# EasyEDA Pro project EasyEDApro.epro

# Schematic Main board
Create Date: 2023-12-25; Page Name: Sheet_1.1; Project Name: Indoor Air Quality sensor; Schematic Name: Main board; Update Date: 2024-01-22; Company: Robonomics.network; Drawed: ludovich88; Page Size: A3; Part Number: ES-SDS-ESP8266; Reviewed: ludovich88; Version: V0.1
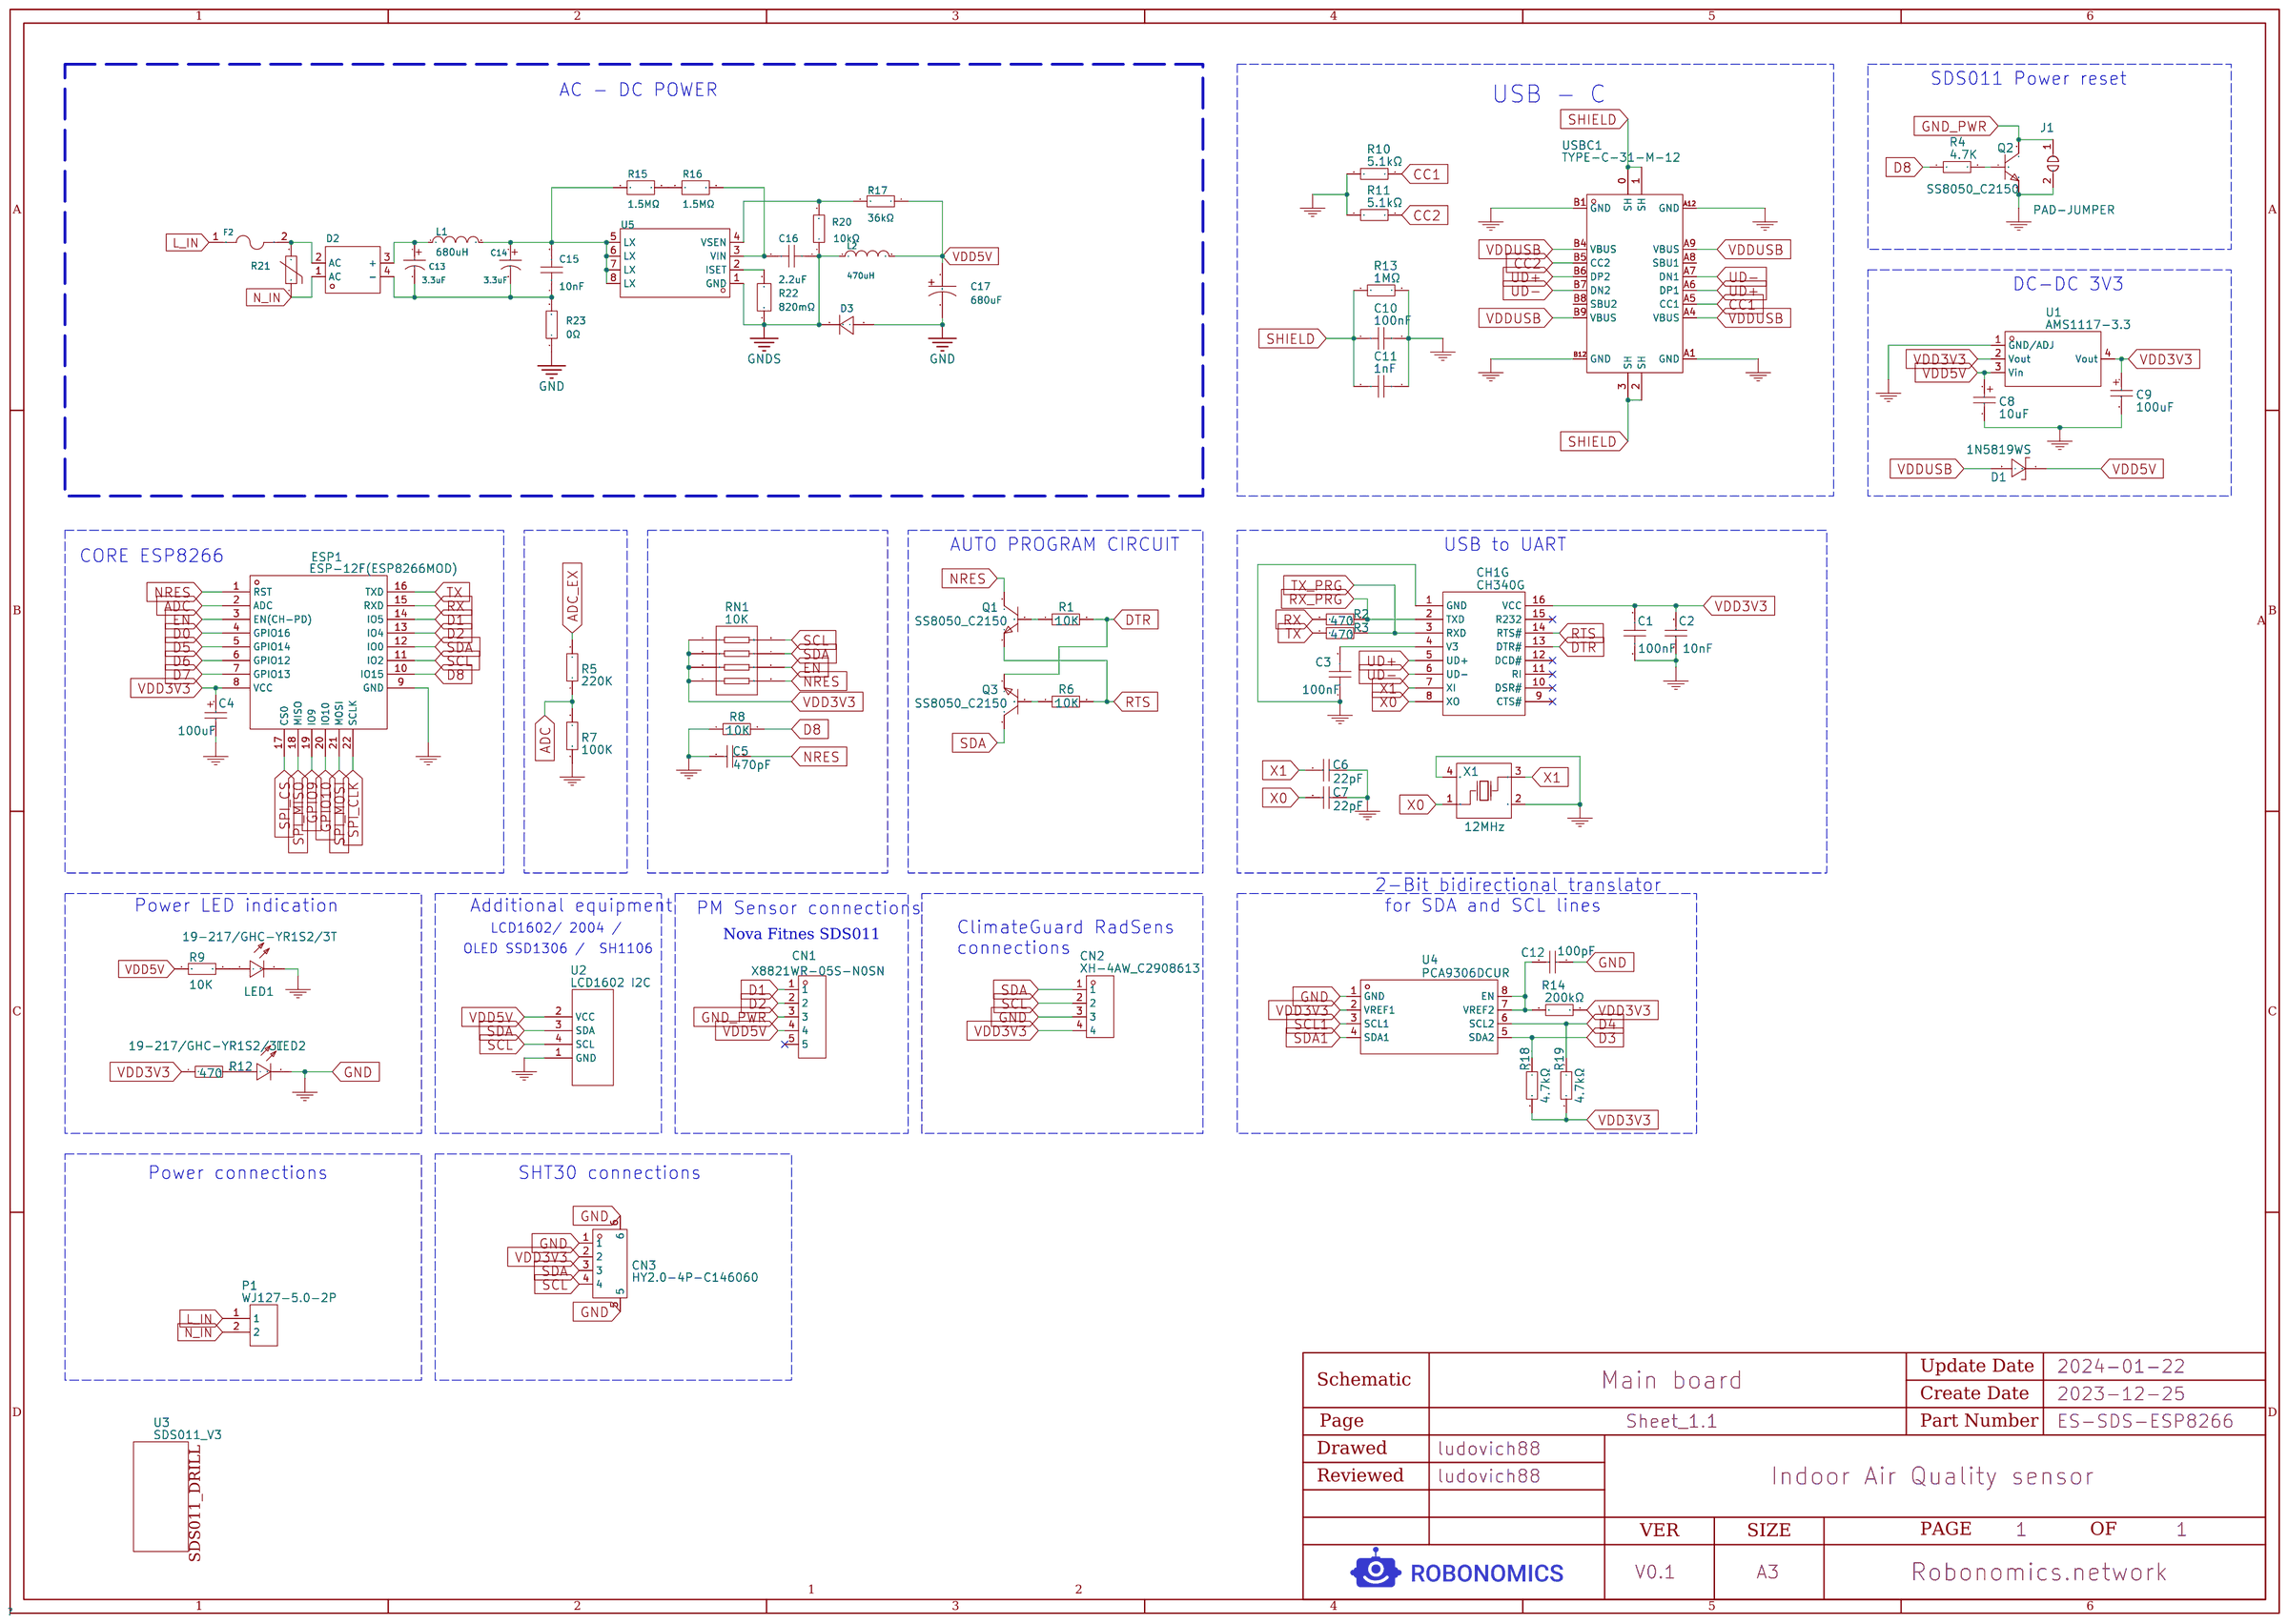
[diagram p0: schematic sheet]

## Parts
C1  100nF  [C0603]
C2  10nF  [C0603]
C3  100nF  [C0603]
C4  100uF  [CAP-SMD_L3.5-W2.8]
C5  470pF  [C0603]
C6  22pF  [C0603]
C7  22pF  [C0603]
C8  10uF  [CAP-SMD_L3.2-W1.6-R-RD]
C9  100uF  [CAP-SMD_L3.5-W2.8]
C10  100nF  [C0603]
C11  1nF  [C0603]
C12  100pF  [C0603]  (no BOM)
C13  3.3uF  [CAP-SMD_BD8.0-L8.3-W8.3-FD]
C14  3.3uF  [CAP-SMD_BD8.0-L8.3-W8.3-FD]
C15  10nF  [C1206]
C16  2.2uF  [C0805]
C17  680uF  [CAP-SMD_L7.3-W4.3]
CH1G  CH340G  [SOIC-16_150MIL]
CN1  X8821WR-05S-N0SN  [CONN-TH_5P-P2.50_X8821WR-05S-N0SN]
CN2  XH-4AW_C2908613  [CONN-TH_XH-4AW]
CN3  HY2.0-4P-C146060  [CONN-SMD_HY2.0-4P]
D1  1N5819WS  [SOD-323_L1.8-W1.3-LS2.5-RD]
D2  MB10F  [MBF_L4.8-W3.9-P2.50-LS6.7-BL]
D3  ES1J  [SMA_L4.3-W2.6-LS5.2-RD]
ESP1  ESP-12F(ESP8266MOD)  [WIFIM-SMD_ESP-12F-ESP8266MOD]
F2  JFC2410-1200FS  [F2410]
J1  PAD-JUMPER  [PAD-JUMPER-2_1]  (no BOM)
L1  680uH  [IND-SMD_L6.0-W6.0]
L2  470uH  [IND-SMD_L4.0-W4.0]
LED1  19-217/GHC-YR1S2/3T  [LED0603-R-RD]
LED2  19-217/GHC-YR1S2/3T  [LED0603-R-RD]
P1  WJ127-5.0-2P  [CONN-TH_2P-P5.00_CPC3703CTR]
Q1  SS8050_C2150  [SOT-23-3_L2.9-W1.3-P1.90-LS2.4-BR]
Q2  SS8050_C2150  [SOT-23-3_L2.9-W1.3-P1.90-LS2.4-BR]
Q3  SS8050_C2150  [SOT-23-3_L2.9-W1.3-P1.90-LS2.4-BR]
R1  10K  [R0603]
R2  470  [R0603]
R3  470  [R0603]
R4  4.7K  [R0603]
R5  220K  [R0603]
R6  10K  [R0603]
R7  100K  [R0603]
R8  10K  [R0603]
R9  10K  [R0603]
R10  5.1kΩ  [R0603]
R11  5.1kΩ  [R0603]
R12  470  [R0603]
R13  1MΩ  [R0603]
R14  200kΩ  [R0603]  (no BOM)
R15  1.5MΩ  [R1206]
R16  1.5MΩ  [R1206]
R17  36kΩ  [R0805]
R18  4.7kΩ  [R0603]  (no BOM)
R19  4.7kΩ  [R0603]  (no BOM)
R20  10kΩ  [R0805]
R21  07D471K68RV0149  [RES-SMD_L8.2-W6.3]
R22  820mΩ  [R0805]
R23  0Ω  [R0805]
RN1  10K  [RES-ARRAY-SMD_0603-8P-L3.2-W1.6-BL]
U1  AMS1117-3.3  [SOT-223-3_L6.5-W3.4-P2.30-LS7.0-BR]
U2  LCD1602 I2C  [LCD1620 I2C]  (no BOM)
U3  SDS011_V3  [SDS011_V3]  (no BOM)
U4  PCA9306DCUR  [SSOP-8_L2.0-W2.3-P0.50-LS3.1-BR]  (no BOM)
U5  SY50282FAC  [SOIC-8_L4.9-W3.9-P1.27-LS6.0-BL]
USBC1  TYPE-C-31-M-12  [USB-C_SMD-TYPE-C-31-M-12]
X1  12MHz  [OSC-SMD_4P-L3.2-W2.5-BL]

## Library data of the parts
C1 C3 C10 = CC0603KRX7R9BB104: Supplier: LCSC; Manufacturer: YAGEO; Supplier Part: C14663; JLCPCB Part Class: BasicPart
C2 = 0603B103K500NT: Supplier: LCSC; Manufacturer: FH; Supplier Part: C57112; JLCPCB Part Class: BasicPart
C4 C9 = TAJB107K006RNJ: Supplier: LCSC; Manufacturer: AVX; Supplier Part: C16133; JLCPCB Part Class: BasicPart
C5 = 0603B471K500NT: Supplier: LCSC; Manufacturer: FH; Supplier Part: C1620; JLCPCB Part Class: BasicPart
C6 C7 = CL10C220JB8NNNC: Supplier: LCSC; Manufacturer: SAMSUNG; Supplier Part: C1653; JLCPCB Part Class: BasicPart
C8 = CA45-A010M106T: Supplier: LCSC; Manufacturer: Xiangyee; Supplier Part: C127946; JLCPCB Part Class: ExtendedPart
C11 = GRM1885C1H102FA01D: Supplier: LCSC; Supplier Part: C913702; Manufacturer: muRata(村田); JLCPCB Part Class: ExtendedPart
C12 = CL10C101JB8NNNC: Supplier: LCSC; Manufacturer: SAMSUNG; Supplier Part: C14858; JLCPCB Part Class: BasicPart
C13 C14 = UV2G3R3M0810: Capacitance: Tolerance:±20% Tolerance:±20% Rated Voltage: Ripple Current:- Equivalent Series Resistance(ESR):- φD: L: Lifetime @ Temp:3000hrs@105℃ Operating Temperature:-45℃~+105℃ Operating Temperature:-45℃~+105℃; LCSC Part Name: 3.3uF ±20% 400V; Supplier Part: C98554; Manufacturer: HONOR(荣誉); Supplier Footprint: SMD,D8xL10.2mm; JLCPCB Part Class: Extended Part; Datasheet: https://atta.szlcsc.com/upload/public/pdf/source/20170311/1489227743043.pdf; Supplier: LCSC; Tolerance: ±20%; Lifetime @ Temp: 3000hrs@105℃; Operating Temperature: -45℃~+105℃
C15 = 1206B103K102CT_C77498: Capacitance:Tolerance:±10%Tolerance:±10%VoltageRated:TemperatureCoefficient:; LCSC Part Name: 10nF±10%1kV; Supplier Part: C77498; Manufacturer: Walsin(华新科); Manufacturer Part: 1206B103K102CT; Supplier Footprint: 1206; Datasheet: https://atta.szlcsc.com/upload/public/pdf/source/20180823/C77498_F5DB9DEE771DDE1CDD0779C01702A5D3.pdf; Supplier: LCSC; Tolerance: ±10%
C16 = CL21A225KBQNNNE: Capacitance:Tolerance:±10%Tolerance:±10%VoltageRated:TemperatureCoefficient:; LCSC Part Name: 2.2uF±10%50V; Supplier Part: C377773; Manufacturer: SAMSUNG(三星); Supplier Footprint: 0805; JLCPCB Part Class: ExtendedPart; Datasheet: https://atta.szlcsc.com/upload/public/pdf/source/20190327/C377773_F663556E8B678C5EA7A210E6B154453B.pdf; Supplier: LCSC; Tolerance: ±10%
C17 = TAJE687K006RNJ: Capacitance:Tolerance:±10%Tolerance:±10%RatedVoltage:EquivalentSeriesResistance(ESR):500mΩ@100kHzOperatingTemperature:-55℃~+125℃OperatingTemperature:-55℃~+125℃; LCSC Part Name: 680uF±10%6.3V; Supplier Part: C308811; Manufacturer: KyoceraAVX; Supplier Footprint: CASE-E-7343; JLCPCB Part Class: ExtendedPart; Datasheet: https://atta.szlcsc.com/upload/public/pdf/source/20181031/C308811_5A7B8BD02B1566F52935A1016FD2A024.pdf; Supplier: LCSC; Tolerance: ±10%; Equivalent Series Resistance(ESR): 500mΩ@100kHz; Operating Temperature: -55℃~+125℃
CH1G = CH340G: Supplier: LCSC; Manufacturer: WCH; image: //image.lceda.cn/szlcsc/C14267.jpg; Supplier Part: C14267; JLCPCB Part Class: Basic
CN1 = X8821WR-05S-N0SN: Supplier: LCSC; Supplier Part: C388742; Manufacturer: XKBConnectivity(中国星坤); JLCPCB Part Class: ExtendedPart
CN2 = XH-4AW: Supplier: LCSC; Supplier Part: C2908613; Manufacturer: HCTL(华灿天禄); JLCPCB Part Class: ExtendedPart
CN3 = HY-4P卧贴: Supplier: LCSC; Supplier Part: C146060; Manufacturer: BOOMELE(博穆精密); JLCPCB Part Class: ExtendedPart
D1 = 1N5819WS: Supplier: LCSC; Supplier Part: C191023; Manufacturer: GuangdongHottech; JLCPCB Part Class: BasicPart
D2 = MB10F_C306850: ReverseVoltage(Vr):AverageRectifiedCurrent(Io):ForwardVoltage(Vf@If):1V@500mAReverseLeakageCurrent(Ir):5uA@1kVPeakForwardSurgeCurrent:OperatingTemperature:-55℃~+150℃@(Tj)OperatingTemperature:-55℃~+150℃@(Tj); LCSC Part Name: 1kV800mA; Supplier Part: C306850; Manufacturer: BORN(伯恩半导体); Supplier Footprint: MBF; JLCPCB Part Class: ExtendedPart; Datasheet: https://atta.szlcsc.com/upload/public/pdf/source/20180927/C306850_59365E2CFC1E948275A4282033719DF3.pdf; Supplier: LCSC; Forward Voltage (Vf@If): 1V@500mA; Reverse Leakage Current (Ir): 5uA@1kV; Operating Temperature: -55℃~+150℃@(Tj)
D3 = ES1J_C115404: Supplier Part: C115404; Manufacturer: 晶导微电子; Supplier Footprint: SMA(DO-214AC); Datasheet: https://atta.szlcsc.com/upload/public/pdf/source/20170704/1499151315665.pdf; Supplier: LCSC
ESP1 = ESP-12F(ESP8266MOD): Supplier: LCSC; Manufacturer: Ai-Thinker; Supplier Part: C82891
F2 = JFC2410-1200FS: Type:SMD Fuse Current Rating:2A Voltage Rating  (AC):250V Breaking Capacity:50A Operating Temperature:-55℃~+125℃ Operating Temperature:-55℃~+125℃; LCSC Part Name: 250V贴片式保险丝; Supplier Part: C136365; Manufacturer: JDTfuse(集电通); Supplier Footprint: SMD; JLCPCB Part Class: Extended Part; Datasheet: https://atta.szlcsc.com/upload/public/pdf/source/20230515/4DD82964BD259009D7CA201DAB95185E.pdf; Supplier: LCSC; Type: SMD Fuse; Current Rating: 2A; Voltage Rating  (AC): 250V; Breaking Capacity: 50A; Operating Temperature: -55℃~+125℃
J1 = PAD-JUMPER
L1 = YNR6045-681M: Inductance:Tolerance:±20%Tolerance:±20%RatedCurrent:DCResistance(DCR):; LCSC Part Name: 680uH±20%330mA2.5Ω; Supplier Part: C497844; Manufacturer: YJYCOIN(益嘉源); Supplier Footprint: SMD,6x6mm; JLCPCB Part Class: ExtendedPart; Datasheet: https://atta.szlcsc.com/upload/public/pdf/source/20200317/C497838_ADAADDA66AFC043F2D8B9A62FB946728.pdf; Supplier: LCSC; Tolerance: ±20%
L2 = PNLS4030-471: Inductance: Tolerance:±20% Tolerance:±20% Rated Current: Type:磁胶电感 DC Resistance (DCR): Saturation Current (Isat):- Ratings:-; LCSC Part Name: 470uH ±20%; Supplier Part: C2849480; Manufacturer: DMBJ(振宝佳); Supplier Footprint: SMD,4x4x3mm; JLCPCB Part Class: Extended Part; Datasheet: https://atta.szlcsc.com/upload/public/pdf/source/20211011/C2849563_90EF936162E15AB6B17B47214801A168.pdf; Supplier: LCSC; Tolerance: ±20%; Type: 磁胶电感
LED1 LED2 = 19-217/GHC-YR1S2/3T: Supplier: LCSC; Manufacturer: EVERLIGHT; Supplier Part: C72043; JLCPCB Part Class: BasicPart
P1 = WJ127-5.0-2P: Supplier: LCSC; Manufacturer: KANGNEX(康奈克斯电气); Supplier Part: C3703; JLCPCB Part Class: ExtendedPart
Q1-Q3 = SS8050: Supplier: LCSC; Manufacturer: CJ; Supplier Part: C2150; JLCPCB Part Class: BasicPart
R1 R6 R8 R9 = 0603WAF1002T5E: Supplier: LCSC; Manufacturer: UniOhm; Supplier Part: C25804; JLCPCB Part Class: BasicPart
R2 R3 R12 = 0603WAF4700T5E: Supplier: LCSC; Manufacturer: UniOhm; Supplier Part: C23179; JLCPCB Part Class: BasicPart
R4 R18 R19 = 0603WAF4701T5E: Supplier: LCSC; Manufacturer: UniOhm; Supplier Part: C23162; JLCPCB Part Class: BasicPart
R5 = 0603WAF2203T5E: Supplier: LCSC; Manufacturer: UniOhm; Supplier Part: C22961; JLCPCB Part Class: BasicPart
R7 = 0603WAF1003T5E: Supplier: LCSC; Manufacturer: UniOhm; Supplier Part: C25803; JLCPCB Part Class: BasicPart
R10 R11 = 0603WAF5101T5E: Supplier: LCSC; Manufacturer: UNI-ROYAL(厚声); Supplier Part: C23186; Resistance: 5.1K; JLCPCB Part Class: BasicPart
R13 = 0603WAF1004T5E: Supplier: LCSC; Manufacturer: UNI-ROYAL(厚声); Supplier Part: C22935; Resistance: 1M; JLCPCB Part Class: BasicPart
R14 = 0603WAF2003T5E: Supplier: LCSC; Manufacturer: UniOhm; Supplier Part: C25811; Resistance: 200K; JLCPCB Part Class: BasicPart
R15 R16 = AC1206FR-071M5L: Power(Watts):250mWBodyLength:-Tolerance:OperatingTemperatureRange:OperatingTemperatureRange:φD:-BodyHeight:-Resistance:BodyWidth:-Type:ThickFilmResistorsTemperatureCoefficient:TemperatureCoefficient:OverloadVoltage(Max):; LCSC Part Name: 1.5MΩ±1%; Supplier Part: C229411; Manufacturer: YAGEO(国巨); Supplier Footprint: 1206; JLCPCB Part Class: ExtendedPart; Datasheet: https://atta.szlcsc.com/upload/public/pdf/source/20190415/C229411_FA1574342AB9C159EA3612F925293BBE.pdf; Supplier: LCSC; Power(Watts): 250mW; Type: ThickFilmResistors
R17 = 0805W8F3602T5E: Type:ThickFilmResistorsResistance:Tolerance:±1%Tolerance:±1%Power(Watts):TemperatureCoefficient:±100ppm/℃TemperatureCoefficient:±100ppm/℃OverloadVoltage(Max):OperatingTemperatureRange:-55℃~+155℃OperatingTemperatureRange:-55℃~+155℃; LCSC Part Name: 36kΩ±1%125mW; Supplier Part: C4360; Manufacturer: UNI-ROYAL(厚声); Supplier Footprint: 0805; JLCPCB Part Class: BasicPart; Datasheet: https://atta.szlcsc.com/upload/public/pdf/source/20200306/C422600_1E6D84923E4A46A82E41ADD87F860B5C.pdf; Supplier: LCSC; Type: ThickFilmResistors; Tolerance: ±1%; Temperature Coefficient: ±100ppm/℃; Operating Temperature Range: -55℃~+155℃
R20 = 0805W8F1002T5E: Type:ThickFilmResistorsResistance:Tolerance:±1%Tolerance:±1%Power(Watts):TemperatureCoefficient:±100ppm/℃TemperatureCoefficient:±100ppm/℃OverloadVoltage(Max):OperatingTemperatureRange:-55℃~+155℃OperatingTemperatureRange:-55℃~+155℃; LCSC Part Name: 10kΩ±1%125mW; Supplier Part: C17414; Manufacturer: UNI-ROYAL(厚声); Supplier Footprint: 0805; JLCPCB Part Class: BasicPart; Datasheet: https://atta.szlcsc.com/upload/public/pdf/source/20200306/C422600_1E6D84923E4A46A82E41ADD87F860B5C.pdf; Supplier: LCSC; Type: ThickFilmResistors; Tolerance: ±1%; Temperature Coefficient: ±100ppm/℃; Operating Temperature Range: -55℃~+155℃
R21 = 07D471K68RV0149: Allowable Voltage (AC): Allowable Voltage (DC): Varistor Voltage:423V~517V Varistor Voltage:423V~517V Clamping Voltage: Peak Current: Maximum Energy:20J Maximum Energy:20J Typical Capatitance:140pF@1kHz; LCSC Part Name: 贴片 775V 20焦耳; Supplier Part: C2836432; Manufacturer: KNSCHA(科尼盛); Supplier Footprint: SMD,3225; JLCPCB Part Class: Extended Part; Datasheet: https://atta.szlcsc.com/upload/public/pdf/source/20220505/AA8F3A0EE096C907DE4148B38AA17D85.pdf; Supplier: LCSC; Varistor Voltage: 423V~517V; Maximum Energy: 20J; Typical Capatitance: 140pF@1kHz
R22 = 0805W8F820LT5E: Resistance:820mΩ Tolerance:±1% Tolerance:±1% Power(Watts): Overload Voltage (Max): Temperature Coefficient:±800ppm/℃ Temperature Coefficient:±800ppm/℃ Type:Thick Film Resistors Operating Temperature Range:-55℃~+155℃ Operating Temperature Range:-55℃~+155℃; LCSC Part Name: 820mΩ ±1% 125mW 厚膜电阻; Supplier Part: C25267; Manufacturer: UNI-ROYAL(厚声); Supplier Footprint: 0805; JLCPCB Part Class: Extended Part; Datasheet: https://atta.szlcsc.com/upload/public/pdf/source/20200306/C422600_1E6D84923E4A46A82E41ADD87F860B5C.pdf; Supplier: LCSC; Tolerance: ±1%; Temperature Coefficient: ±800ppm/℃; Type: Thick Film Resistors; Operating Temperature Range: -55℃~+155℃
R23 = 0805W8J0000T5E: Type:ThickFilmResistorsResistance:Tolerance:±5%Tolerance:±5%Power(Watts):OverloadVoltage(Max):OperatingTemperatureRange:-55℃~+155℃OperatingTemperatureRange:-55℃~+155℃; LCSC Part Name: 0Ω±5%125mW; Supplier Part: C25275; Manufacturer: UNI-ROYAL(厚声); Supplier Footprint: 0805; Datasheet: https://atta.szlcsc.com/upload/public/pdf/source/20200306/C422600_1E6D84923E4A46A82E41ADD87F860B5C.pdf; Supplier: LCSC; Type: ThickFilmResistors; Tolerance: ±5%; Operating Temperature Range: -55℃~+155℃
RN1 = 4D03WGJ0103T5E: Supplier: LCSC; Manufacturer: UniOhm; Supplier Part: C29718; JLCPCB Part Class: BasicPart
U1 = AMS1117-3.3: Supplier: LCSC; Manufacturer: AMS; Supplier Part: C6186; JLCPCB Part Class: BasicPart
U2 = LCD1602 I2C: Manufacturer Part: LCD1602I2C
U3 = SDS011_V3
U4 = PCA9306DCUR: Supplier: LCSC; Manufacturer: TI; Supplier Part: C33196; JLCPCB Part Class: ExtendedPart
U5 = SY50282FAC: Supplier Part: C178237; Manufacturer: silergy(矽力杰); Supplier Footprint: SOIC-8; JLCPCB Part Class: ExtendedPart; Datasheet: https://atta.szlcsc.com/upload/public/pdf/source/20180207/C178237_15179896323851356347.pdf; Supplier: LCSC
USBC1 = KH-TYPE-C-16P: Supplier: LCSC; Supplier Part: C709357; Manufacturer: kinghelm(金航标); JLCPCB Part Class: ExtendedPart
X1 = X322512MSB4SI: Supplier: LCSC; Manufacturer: YXC; Supplier Part: C9002; JLCPCB Part Class: BasicPart

## Nets
GND: C1.1 C2.1 C3.1 C4.2 C5.1 C6.1 C7.1 C8.1 C9.2 C10.2 C11.2 C12.1 C17.2 CH1G.1(GND) CN2.3 CN3.1 CN3.5 CN3.6 D3.2(A) ESP1.9(GND) J1.2(B) LED1.2(C) LED2.2(C) Q2.2(E) R7.1 R8.1 R10.1 R11.1 R13.2 R23.1 U1.1(GND/ADJ) U2.1(GND) U4.1(GND) USBC1.A1(GND) USBC1.A12(GND) USBC1.B1(GND) USBC1.B12(GND) X1.2(GND) X1.4(GND)
GND_PWR: CN1.3 J1.1(A) Q2.3(C)
GNDS: C16.1 D3.1(C) L2.1 R20.1 R22.1 U5.1(GND)
VDD3V3: C1.2 C2.2 C4.1 C9.1 CH1G.16(VCC) CN2.4 CN3.2 ESP1.8(VCC) R12.1 R14.2 R18.2 R19.2 RN1.1 RN1.2 RN1.3 RN1.4 U1.2(Vout) U1.4(Vout) U4.2(VREF1)
VDD5V: C8.2 C17.1 CN1.4 D1.1(C) L2.2 R9.1 R17.1 U1.3(Vin) U2.2(VCC)
VDDUSB: D1.2(A) USBC1.A4(VBUS) USBC1.A9(VBUS) USBC1.B4(VBUS) USBC1.B9(VBUS)
ADC: ESP1.2(ADC) R5.1 R7.2
ADC_EX: R5.2
CC1: R10.2 USBC1.A5(CC1)
CC2: R11.2 USBC1.B5(CC2)
D0: ESP1.4(GPIO16)
D1: CN1.1 ESP1.14(IO5)
D2: CN1.2 ESP1.13(IO4)
D3: R18.1 U4.5(SDA2)
D4: R19.1 U4.6(SCL2)
D5: ESP1.5(GPIO14)
D6: ESP1.6(GPIO12)
D7: ESP1.7(GPIO13)
D8: ESP1.10(IO15) R4.1 R8.2
DTR: CH1G.13(DTR#) Q3.2(E) R1.2
EN: ESP1.3(EN(CH-PD)) RN1.6
GPIO9: ESP1.19(IO9)
GPIO10: ESP1.20(IO10)
L_IN: F2.1 P1.1
N_IN: D2.1(AC) P1.2 R21.1
NRES: C5.2 ESP1.1(RST) Q1.3(C) RN1.5
RTS: CH1G.14(RTS#) Q1.2(E) R6.2
RX: ESP1.15(RXD) R2.1
RX_PRG: CH1G.2(TXD) R2.2
SCL: CN2.2 CN3.4 ESP1.11(IO2) RN1.8 U2.4(SCL)
SCL1: U4.3(SCL1)
SDA: CN2.1 CN3.3 ESP1.12(IO0) Q3.3(C) RN1.7 U2.3(SDA)
SDA1: U4.4(SDA1)
SHIELD: C10.1 C11.1 R13.1 USBC1.0(SH) USBC1.1(SH) USBC1.2(SH) USBC1.3(SH)
SPI_CLK: ESP1.22(SCLK)
SPI_CS: ESP1.17(CS0)
SPI_MISO: ESP1.18(MISO)
SPI_MOSI: ESP1.21(MOSI)
TX: ESP1.16(TXD) R3.1
TX_PRG: CH1G.3(RXD) R3.2
UD+: CH1G.5(UD+) USBC1.A6(DP1) USBC1.B6(DP2)
UD-: CH1G.6(UD-) USBC1.A7(DN1) USBC1.B7(DN2)
X0: C7.2 CH1G.8(XO) X1.1(OSC1)
X1: C6.2 CH1G.7(XI) X1.3(OSC2)
$1N258: Q3.1(B) R6.1
$1N259: Q1.1(B) R1.1
$1N445: C3.2 CH1G.4(V3)
$1N571: Q2.1(B) R4.2
$1N918: LED1.1(A) R9.2
$1N1452: LED2.1(A) R12.2
$1N12391: R15.2 R16.1
$1N12392: R22.2 U5.2(ISET)
$1N12393: C16.2 R16.2 U5.3(VIN)
$1N12394: R17.2 R20.2 U5.4(VSEN)
$1N12400: C13.1 D2.3(+) L1.1
$1N12406: D2.2(AC) F2.2 R21.2
$1N12488: C14.1 C15.2 L1.2 R15.1 U5.5(LX) U5.6(LX) U5.7(LX) U5.8(LX)
$1N12654: C13.2 C14.2 C15.1 D2.4(-) R23.2
Net-(C12-2): C12.2 R14.1 U4.7(VREF2) U4.8(EN)

Not connected (* = marked no-connect by the designer): CH1G 9(CTS#)* 10(DSR#)* 11(RI)* 12(DCD#)* 15(R232)*; CN1 5*; USBC1 A8(SBU1) B8(SBU2)

## Notes on the sheet
- SDS011 Power reset
- AC - DC POWER
- USB - C
- DC-DC 3V3
- CORE ESP8266
- AUTO PROGRAM CIRCUIT
- USB to UART
- Power LED indication
- Additional equipment
- PM Sensor connections
- ClimateGuard RadSens
  connections
- 2-Bit bidirectional translator
   for SDA and SCL lines
- LCD1602/ 2004 /
- OLED SSD1306 /  SH1106
- Nova Fitnes SDS011
- Power connections
- SHT30 connections

# Board PCB
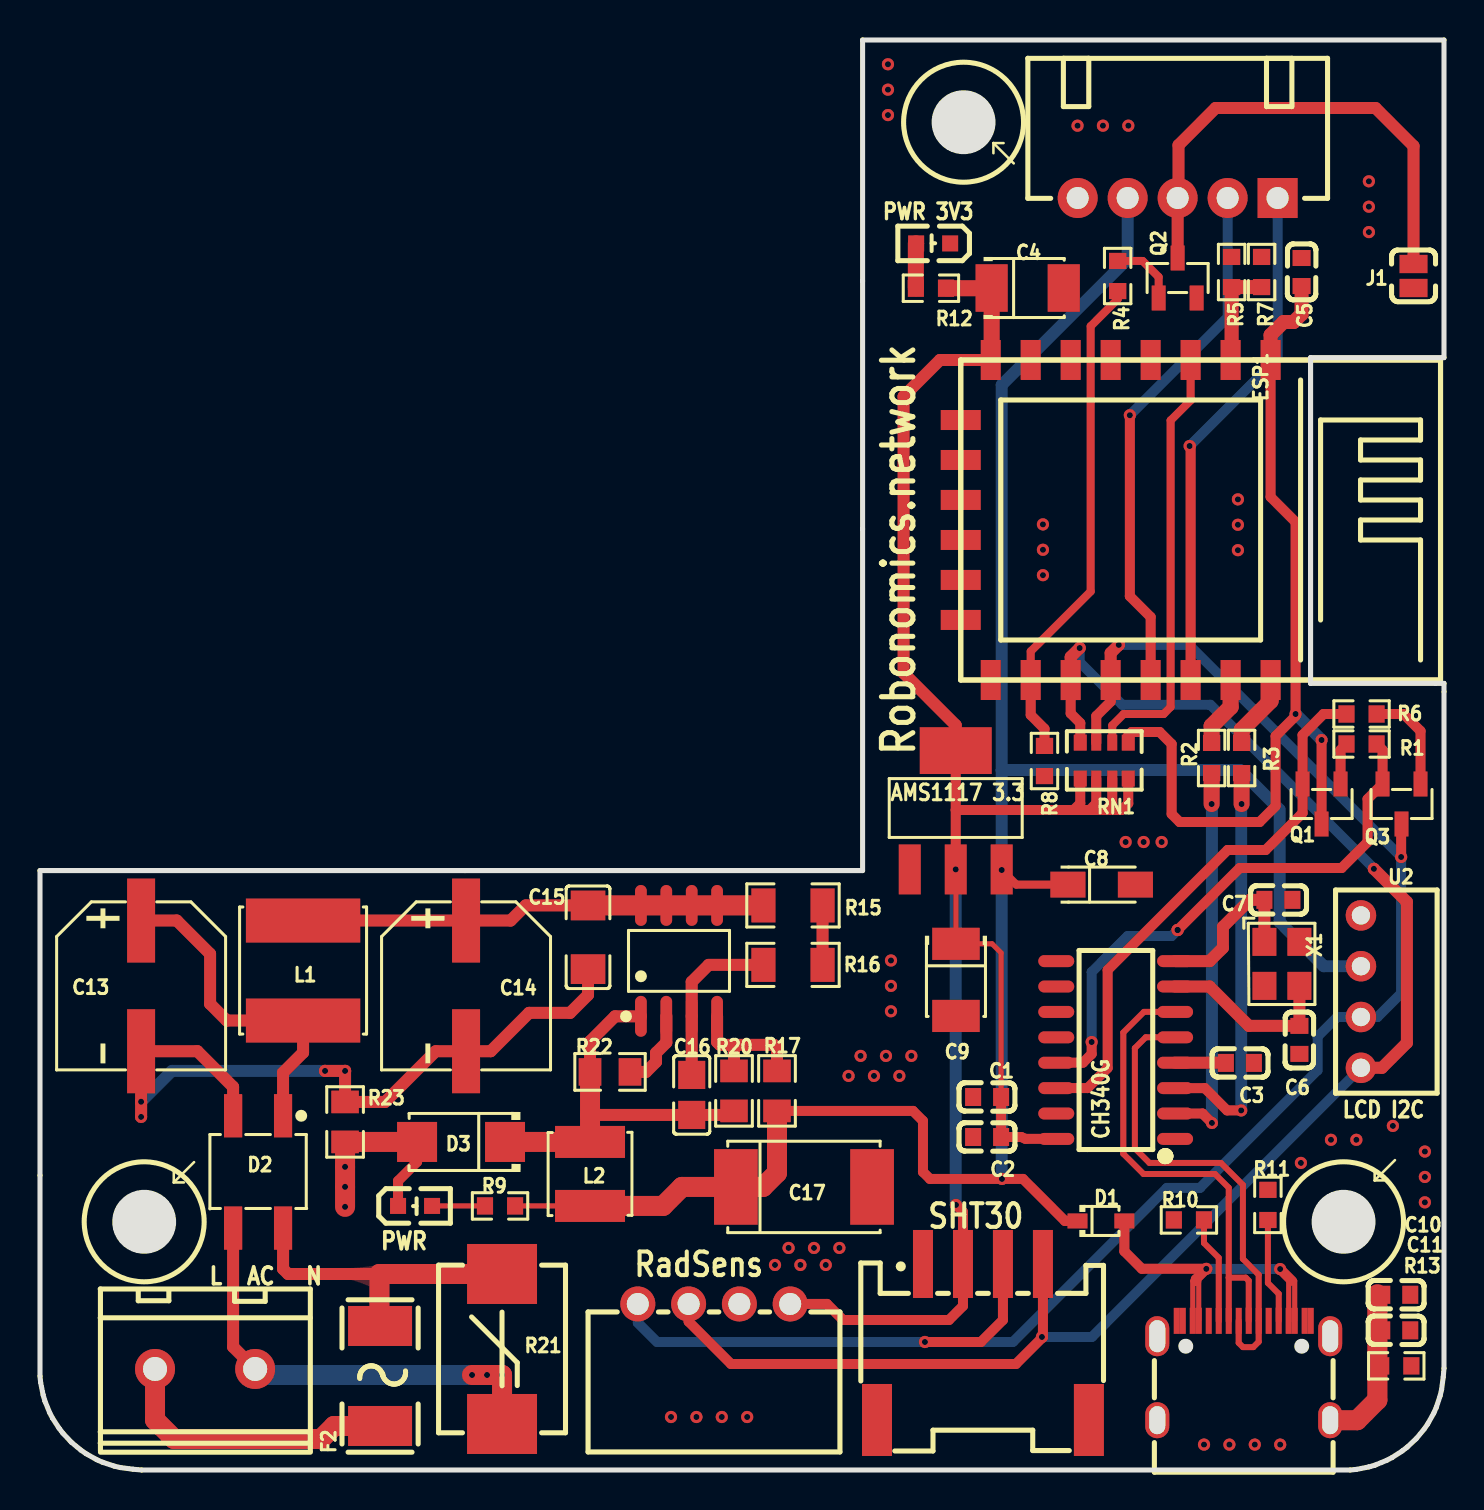
[diagram p1: board, top side]
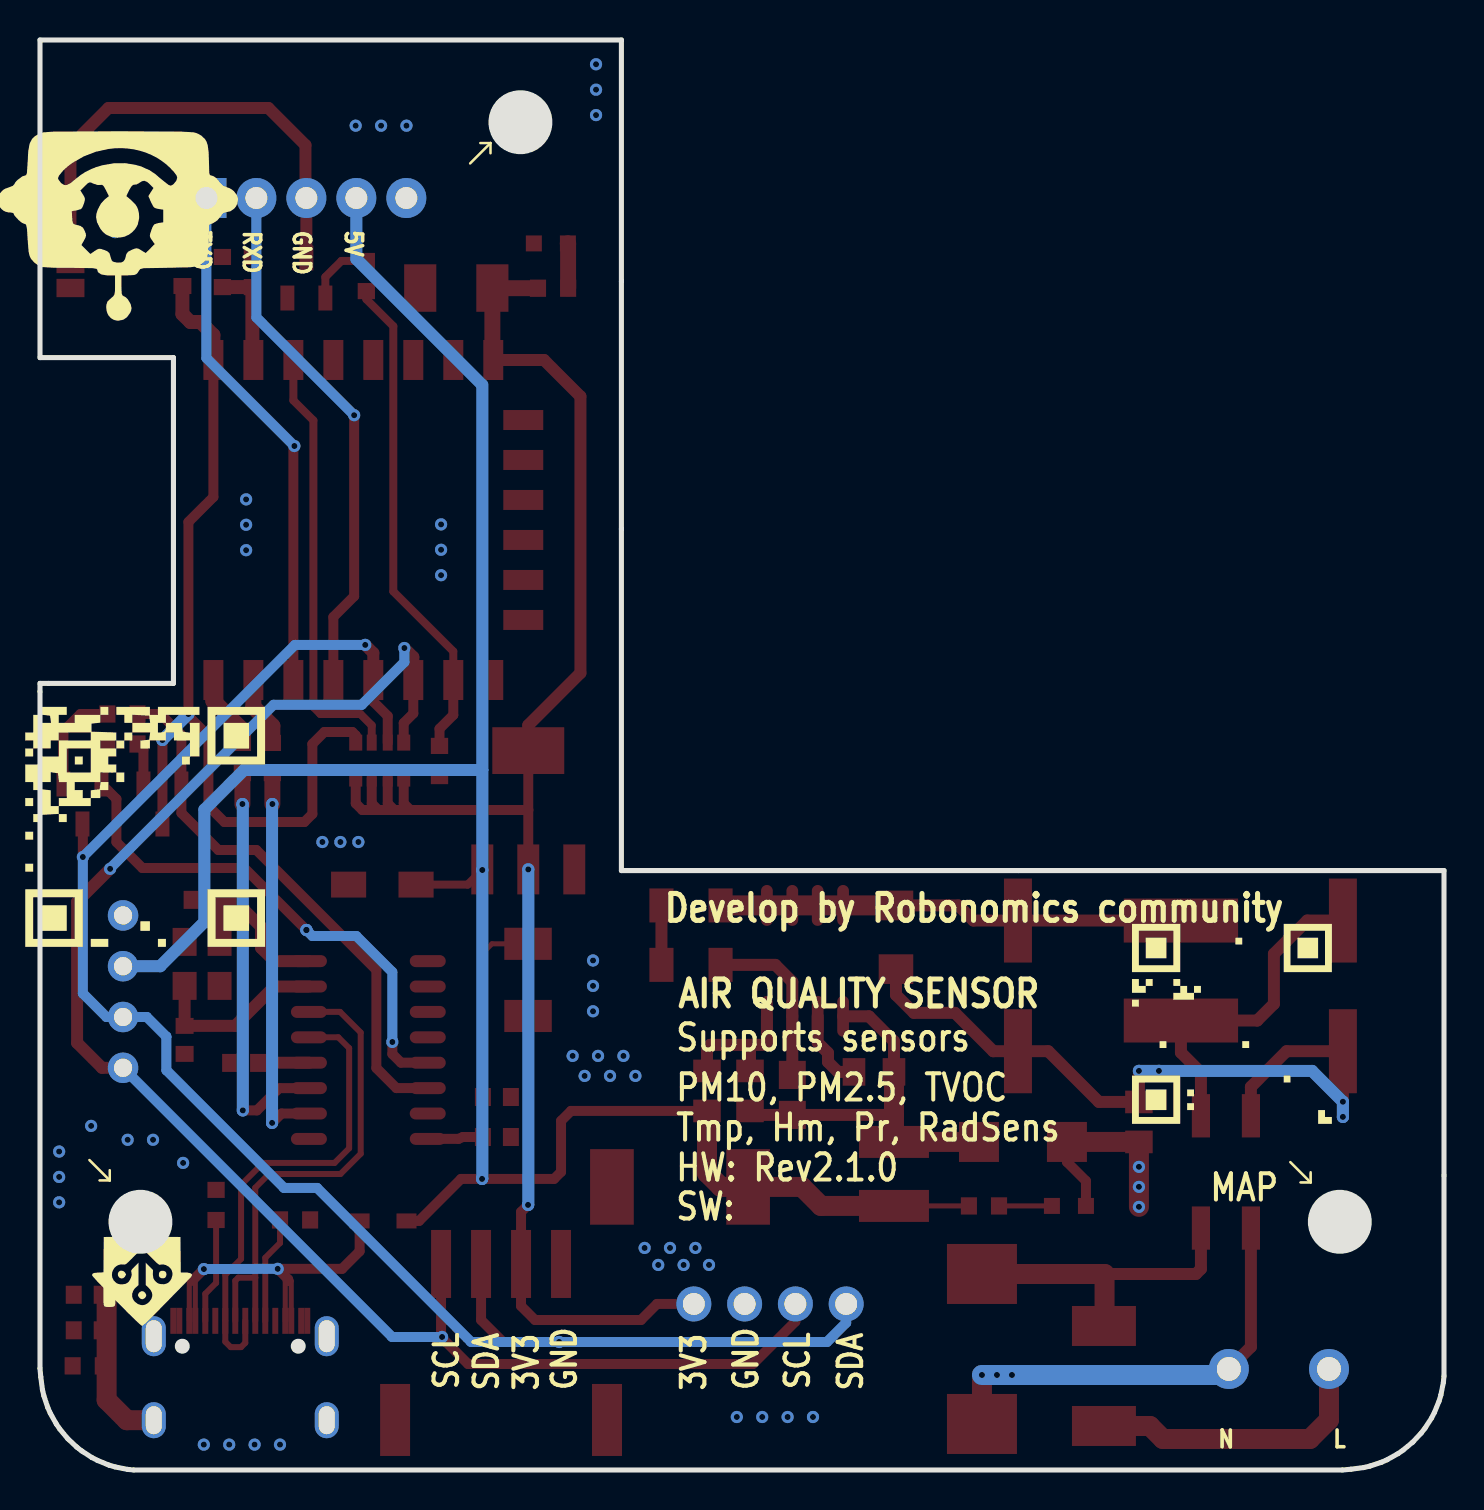
[diagram p2: board, bottom side, seen from below]

Outline 70.23 x 71.5 mm; copper layers: Top Layer, Bottom Layer. Coordinates in mm from the lower left corner of the outline.
Outline path: 0,29.97 0,14.73 0,4.7 0.03,4.38 0.16,3.75 0.25,3.45 0.48,2.87 0.62,2.6 0.96,2.08 1.15,1.84 1.57,1.39 2.04,1 2.3,0.82 2.84,0.52 3.12,0.39 3.71,0.19 4.02,0.12 4.66,0.04 5.08,0 65.53,0 65.85,0.03 66.48,0.16 66.78,0.24 67.36,0.48 67.63,0.62 68.15,0.96 68.4,1.15 68.84,1.57 69.24,2.04 69.41,2.3 69.71,2.83 69.84,3.12 70.04,3.71 70.11,4.02 70.19,4.66 70.23,5.08 70.23,38.92 70.23,39.33 69.82,39.33 63.56,39.33 63.56,55.62 70.23,55.62 70.23,71.5 41.15,71.5 41.15,29.97 0,29.97
Stack: Top Layer 0.035mm / Dielectric1 1.51mm FR4 er 4.5 / Bottom Layer 0.035mm

## Design rules (mm)
template: User Custom Config
spacing Default (default): track to track 0.152, other pairs 0 to 0.152
track width Default (default): min 0.254, default 0.254, max 25.4
differential pair differentialPair (default): width min 0.127, default 0.254, max 2.54; gap min 0.152, default 0.152
via Default (default): diameter min 0.61, default 0.61, max 100.025; hole min 0.305, default 0.305, max 59.995
net GND uses copperRegion1
pour e1466 uses copperRegion1

## Placement (name value [footprint] x y rotation side)
C1  100nF  [C0603]  47.38 18.65 0 top
C2  10nF  [C0603]  47.38 16.65 0 top
C3  100nF  [C0603]  60.02 20.36 180 top
C4  100uF  [CAP-SMD_L3.5-W2.8]  49.41 59.1 180 top
C5  470pF  [C0603]  63.11 59.9 270 top
C6  22pF  [C0603]  63 21.51 90 top
C7  22pF  [C0603]  61.95 28.51 180 top
C8  10uF  [CAP-SMD_L3.2-W1.6-R-RD]  53.11 29.27 180 top
C9  100uF  [CAP-SMD_L3.5-W2.8]  45.82 24.51 90 top
C10  100nF  [C0603]  67.84 8.76 0 top
C11  1nF  [C0603]  67.84 6.98 0 top
C13  3.3uF  [CAP-SMD_BD8.0-L8.3-W8.3-FD]  5.06 24.21 270 top
C14  3.3uF  [CAP-SMD_BD8.0-L8.3-W8.3-FD]  21.31 24.21 270 top
C15  10nF  [C1206]  27.41 26.64 90 top
C16  2.2uF  [C0805]  32.6 18.75 90 top
C17  680uF  [CAP-SMD_L7.3-W4.3]  38.22 14.15 180 top
CH1G  CH340G  [SOIC-16_150MIL]  53.81 21 90 top
CN1  X8821WR-05S-N0SN  [CONN-TH_5P-P2.50_X8821WR-05S-N0SN]  56.91 63.6 180 top
CN2  XH-4AW_C2908613  [CONN-TH_XH-4AW]  33.72 8.3 0 top
CN3  HY2.0-4P-C146060  [CONN-SMD_HY2.0-4P]  47.17 6.4 0 top
D1  1N5819WS  [SOD-323_L1.8-W1.3-LS2.5-RD]  53.07 12.45 0 top
D2  MB10F  [MBF_L4.8-W3.9-P2.50-LS6.7-BL]  10.91 14.9 180 top
D3  ES1J  [SMA_L4.3-W2.6-LS5.2-RD]  21.06 16.4 180 top
ESP1  ESP-12F(ESP8266MOD)  [WIFIM-SMD_ESP-12F-ESP8266MOD]  53.81 47.5 270 top
F2  JFC2410-1200FS  [F2410]  17.01 4.7 90 top
J1  PAD-JUMPER  [PAD-JUMPER-2_1]  68.71 59.7 0 top
L1  680uH  [IND-SMD_L6.0-W6.0]  13.16 24.97 90 top
L2  470uH  [IND-SMD_L4.0-W4.0]  27.51 14.8 270 top
LED1  19-217/GHC-YR1S2/3T  [LED0603-R-RD]  18.76 13.2 0 top
LED2  19-217/GHC-YR1S2/3T  [LED0603-R-RD]  44.68 61.33 180 top
P1  WJ127-5.0-2P  [CONN-TH_2P-P5.00_CPC3703CTR]  8.26 5.05 0 top
Q1  SS8050_C2150  [SOT-23-3_L2.9-W1.3-P1.90-LS2.4-BR]  64.11 33.3 90 top
Q2  SS8050_C2150  [SOT-23-3_L2.9-W1.3-P1.90-LS2.4-BR]  56.91 59.6 270 top
Q3  SS8050_C2150  [SOT-23-3_L2.9-W1.3-P1.90-LS2.4-BR]  68.11 33.3 90 top
R1  10K  [R0603]  66.11 36.3 0 top
R2  470  [R0603]  58.61 35.6 270 top
R3  470  [R0603]  60.11 35.6 270 top
R4  4.7K  [R0603]  53.91 59.7 90 top
R5  220K  [R0603]  59.61 59.9 90 top
R6  10K  [R0603]  66.11 37.8 180 top
R7  100K  [R0603]  61.11 59.9 270 top
R8  10K  [R0603]  50.25 35.45 90 top
R9  10K  [R0603]  23.01 13.2 180 top
R10  5.1kΩ  [R0603]  57.47 12.5 0 top
R11  5.1kΩ  [R0603]  61.42 13.25 270 top
R12  470  [R0603]  44.57 59.09 180 top
R13  1MΩ  [R0603]  67.84 5.21 0 top
R15  1.5MΩ  [R1206]  37.67 28.23 0 top
R16  1.5MΩ  [R1206]  37.67 25.26 180 top
R17  36kΩ  [R0805]  36.87 18.95 90 top
R20  10kΩ  [R0805]  34.72 18.95 90 top
R21  07D471K68RV0149  [RES-SMD_L8.2-W6.3]  23.11 6.05 90 top
R22  820mΩ  [R0805]  28.51 19.91 0 top
R23  0Ω  [R0805]  15.26 17.4 90 top
RN1  10K  [RES-ARRAY-SMD_0603-8P-L3.2-W1.6-BL]  53.24 35.47 0 top
U1  AMS1117-3.3  [SOT-223-3_L6.5-W3.4-P2.30-LS7.0-BR]  45.81 33 270 top
U2  LCD1602 I2C  [LCD1620 I2C]  64.81 29 0 top
U3  -  [SDS011_V3]  39.81 34 90 top
U5  SY50282FAC  [SOIC-8_L4.9-W3.9-P1.27-LS6.0-BL]  31.96 25.46 0 top
USBC1  TYPE-C-31-M-12  [USB-C_SMD-TYPE-C-31-M-12]  60.21 4.97 0 top
X1  12MHz  [OSC-SMD_4P-L3.2-W2.5-BL]  62.12 25.31 270 top

## Footprints (pads in the part's own frame, mm; a bottom-side part is the same pattern mirrored in y, then rotated)
C0603
  rect 0.8x0.9 smd: 1(-0.7,0) 2(0.7,0)
C0805
  rect 1.41x1.35 smd: 1(-1,0) 2(1,0)
C1206
  rect 1.485x1.728 smd: 1(-1.593,0) 2(1.593,0)
CAP-SMD_BD8.0-L8.3-W8.3-FD
  rect 4.2x1.4 smd: 1(-3.267,0) 2(3.267,0)
CAP-SMD_L3.2-W1.6-R-RD
  rect 1.758x1.296 smd: 1(-1.687,0) 2(1.687,0)
CAP-SMD_L3.5-W2.8
  rect 1.607x2.376 smd: 1(1.804,0) 2(-1.804,0)
CAP-SMD_L7.3-W4.3
  rect 2.185x3.78 smd: 1(3.406,0) 2(-3.406,0)
CONN-SMD_HY2.0-4P
  rect 1x3.4 smd: 1(-3,3.9) 2(-1,3.9) 3(1,3.9) 4(3,3.9)
  rect 1.5x3.6 smd: 5(5.3,-3.9) 6(-5.3,-3.9)
CONN-TH_2P-P5.00_CPC3703CTR
  round 2 hole 1.2: 1(-2.505,0) 2(2.505,0)
CONN-TH_5P-P2.50_X8821WR-05S-N0SN
  rect 2x2 hole 1.1: 1(-5,0)
  round 2 hole 1.1: 2(-2.5,0) 3(0,0) 4(2.5,0) 5(5,0)
CONN-TH_XH-4AW
  round 1.75 hole 1.1: 1(-3.81,0) 2(-1.27,0) 3(1.27,0) 4(3.81,0)
F2410
  rect 2x3.2 smd: 1(-2.5,0) 2(2.5,0)
IND-SMD_L4.0-W4.0
  rect 1.6x3.5 smd: 1(-1.6,0) 2(1.6,0)
IND-SMD_L6.0-W6.0
  rect 2.2x5.72 smd: 1(-2.5,0) 2(2.5,0)
LCD1620 I2C
  round 1.524 hole 0.914: 1(1.27,-1.27) 2(1.27,-3.81) 3(1.27,-6.35) 4(1.27,-8.89)
LED0603-R-RD
  rect 0.8x0.8 smd: 1(0.851,0) 2(-0.851,0)
MBF_L4.8-W3.9-P2.50-LS6.7-BL
  rect 0.91x2.165 smd: 1(1.25,2.808) 2(-1.25,2.808) 3(-1.25,-2.808) 4(1.25,-2.808)
OSC-SMD_4P-L3.2-W2.5-BL
  rect 1.4x1.2 smd: 1(-1.1,-0.875) 2(1.1,-0.875) 3(1.1,0.875) 4(-1.1,0.875)
PAD-JUMPER-2_1
  rect 1.4x0.914 smd: 1(0,0.6) 2(0,-0.6)
R0603
  rect 0.806x0.864 smd: 1(-0.753,0) 2(0.753,0)
R0805
  rect 1.133x1.377 smd: 1(-1,0) 2(1,0)
R1206
  rect 1.208x1.701 smd: 1(-1.479,0) 2(1.479,0)
RES-ARRAY-SMD_0603-8P-L3.2-W1.6-BL
  rect 0.65x0.8 smd: 1(-1.2,-0.9) 4(1.2,-0.9) 5(1.2,0.9) 8(-1.2,0.9)
  rect 0.5x0.8 smd: 2(-0.4,-0.9) 3(0.4,-0.9) 6(0.4,0.9) 7(-0.4,0.9)
RES-SMD_L8.2-W6.3
  rect 3x3.5 smd: 1(-3.75,0) 2(3.75,0)
SMA_L4.3-W2.6-LS5.2-RD
  rect 2x2 smd: 1(-2.2,0) 2(2.2,0)
SOD-323_L1.8-W1.3-LS2.5-RD
  rect 1x0.75 smd: 1(-1.173,0) 2(1.173,0)
SOIC-8_L4.9-W3.9-P1.27-LS6.0-BL
  oval 0.588x2.045 smd: 1(-1.905,-2.772) 2(-0.635,-2.772) 3(0.635,-2.772) 4(1.905,-2.772) 5(1.905,2.772) 6(0.635,2.772) 7(-0.635,2.772) 8(-1.905,2.772)
SOIC-16_150MIL
  oval 0.6x1.8 smd: 1(-4.445,-2.972) 2(-3.175,-2.972) 3(-1.905,-2.972) 4(-0.635,-2.972) 5(0.635,-2.972) 6(1.905,-2.972) 7(3.175,-2.972) 8(4.445,-2.972) 9(4.445,2.972) 10(3.175,2.972) 11(1.905,2.972) 12(0.635,2.972) 13(-0.635,2.972) 14(-1.905,2.972) 15(-3.175,2.972) 16(-4.445,2.972)
SOT-23-3_L2.9-W1.3-P1.90-LS2.4-BR
  rect 1.25x0.7 smd: 1(1,-0.95) 2(1,0.95) 3(-1,0)
SOT-223-3_L6.5-W3.4-P2.30-LS7.0-BR
  rect 2.5x1.1 smd: 1(2.97,-2.3) 2(2.97,0) 3(2.97,2.3)
  rect 2.34x3.6 smd: 4(-2.97,0)
USB-C_SMD-TYPE-C-31-M-12
  oval 1.2x2 hole 0.8x1.6: 0(-4.325,1.716) 1(4.325,1.716)
  oval 1.2x1.8 hole 0.8x1.4: 2(4.325,-2.484) 3(-4.325,-2.484)
  rect 0.3x1.3 smd: A1(-3.35,2.484) A4(-2.55,2.484) A5(-1.25,2.484) A6(-0.25,2.484) A7(0.25,2.484) A8(1.25,2.484) A9(2.55,2.484) A12(3.35,2.484) B1(3.05,2.484) B4(2.25,2.484) B5(1.75,2.484) B6(0.75,2.484) B7(-0.75,2.484) B8(-1.75,2.484) B9(-2.25,2.484) B12(-3.05,2.484)
WIFIM-SMD_ESP-12F-ESP8266MOD
  rect 2x1 smd: 1(-8.002,7.75) 2(-8.002,5.75) 3(-8.002,3.751) 4(-8.002,1.75) 5(-8.002,-0.249) 6(-8.002,-2.249) 7(-8.002,-4.25) 8(-8.001,-6.25) 9(7.999,-6.25) 10(8,-4.25) 11(8.002,-2.249) 12(8.001,-0.249) 13(8,1.75) 14(8.001,3.751) 15(8.001,5.75) 16(8.001,7.75)
  rect 1x2 smd: 17(-5,-7.75) 18(-3.002,-7.749) 19(-1.003,-7.75) 20(0.998,-7.75) 21(2.997,-7.75) 22(4.997,-7.75)

## Nets
As in the schematic.

Pads without a net: CH1G 9 10 11 12 15; CN1 5; USBC1 A8 B8

## Via types
v1: diameter 0.61, hole 0.305, Top Layer to Bottom Layer, 81 vias

## Routing (per net, layer and track width the routed paths; a pad name or vN(x,y) marks a point on that pad's centre or on a via; arc(x,y) is an arc through that point)
GND: length 10.4
  Top Layer w0.5: LED1.2 17.91,14.45 18.86,15.4 D3.2
  Top Layer w1: D3.2 R23.1 v1(15.26,15.16) v1(15.26,14.16) v1(15.26,13.16)
  vias: v1(31.57,2.65) v1(32.83,2.65) v1(34.11,2.65) v1(35.38,2.65) v1(36.77,10.25) v1(37.45,11.1) v1(38.04,10.25) v1(38.72,11.1) v1(39.31,10.25) v1(39.99,11.1) v1(40.45,19.7) v1(41.05,20.7) v1(41.72,19.7) v1(42.32,20.7) v1(42.42,70.29) v1(42.42,69.02) v1(42.42,67.75) v1(42.57,25.48) v1(42.57,24.21) v1(42.57,22.94) v1(42.99,19.7) v1(43.59,20.7) v1(50.17,47.28) v1(50.17,46.01) v1(50.17,44.74) v1(51.9,67.22) v1(53.17,67.22) v1(54.31,31.4) v1(54.44,67.22) v1(55.21,31.4) v1(56.11,31.4) v1(58.23,1.27) v1(59.5,1.27) v1(59.92,48.53) v1(59.92,47.26) v1(59.92,45.99) v1(60.77,1.27) v1(62.04,1.27) v1(63.07,15.35) v1(64.58,16.51) v1(65.85,16.51) v1(66.47,64.44) v1(66.47,63.17) v1(66.47,61.9) v1(67.67,17.2) v1(69.27,15.92) v1(69.27,14.65) v1(69.27,13.38)
GND_PWR: length 24.9
  Top Layer w0.6: J1.1 68.71,66.2 66.81,68.1 58.81,68.1 56.95,66.25 56.95,63.69 56.91,63.65 Q2.3
GNDS: length 19.6
  Top Layer w0.6: R22.1 27.51,21.43 28.76,22.68 U5.1 ; R20.1 34.52,17.75 C16.1 27.52,17.75 27.51,17.74
  Top Layer w1: D3.1 L2.1 R22.1
VDD3V3: length 100.3
  Top Layer w0.254: v1(45.81,30.03) 45.82,30.02 C9.1 47.62,26.31 48.08,25.86 C1.2
  Top Layer w0.5: RN1.3 53.64,33.33 53.31,33 ; 37.53,8.3 39.37,8.3 40.17,7.5 45.47,7.5 46.17,8.2 CN3.2 46.17,12.9 45.82,13.25 ; 45.81,33 52.51,33 ; 45.81,33 45.81,35.97 ; 45.81,33 v1(45.81,30.03) ; 52.51,33 53.31,33 ; 52.51,33 52.84,33.33 RN1.2 ; RN1.1 52.04,33.33 51.71,33 ; C1.2 C2.2 49.08,16.65 49.3,16.56 CH1G.16 ; 53.31,33 54.11,33 54.44,33.33 RN1.4
  Top Layer w0.6: 47.56,55.5 45.02,55.5 43.2,53.68 43.2,39.85 45.81,37.24 45.81,35.97
  Top Layer w0.8: 45.32,59.09 47.59,59.09 C4.1 47.6,55.55 ESP1.8
  Bottom Layer w0.6: 45.82,13.25 45.81,13.27 v1(45.81,30.03)
  vias: v1(45.82,13.25)
VDD5V: length 116.3
  Top Layer w0.254: R9.1 L2.2
  Top Layer w0.4: v1(48.11,30) 48.84,29.27 C8.2
  Top Layer w0.5: R17.1 43.67,17.95 44.17,17.45 44.17,14.9 44.52,14.55 v1(48.12,14.55) 49.17,14.55 51.27,12.45 51.9,12.45
  Top Layer w1: R17.1 36.87,14.85 36.17,14.15 C17.1 32.11,14.15 31.17,13.2 L2.2 ; U1.3 v1(48.11,30)
  Bottom Layer w0.6: v1(48.12,14.55) 48.11,14.57 v1(48.11,30) 48.11,34.99 ; 48.11,34.99 48.12,35 60.03,35 62.01,33.02 62.01,27.4 64.22,25.19 66.08,25.19 ; 48.11,34.99 48.11,54.25 54.41,60.55 CN1.4
VDDUSB: length 19.9
  Top Layer w0.254: USBC1.B4 62.46,9.46 62.76,9.46 USBC1.A9 ; USBC1.A4 57.66,9.45 57.96,9.45 USBC1.B9
  Top Layer w0.5: D1.2 54.24,10.94 55.12,10.06 v1(58.34,10.06) 57.82,9.53 57.82,9.45 ; v1(62.03,10.05) 62.62,9.46
  Bottom Layer w0.5: v1(58.34,10.06) v1(62.03,10.05)
ADC: length 5.2
  Top Layer w0.7: 61.11,59.15 R5.1 59.61,55.55 ESP1.2
CC1: length 5.4
  Top Layer w0.3: 58.96,7.45 58.96,10.61 58.23,11.35 R10.2
CC2: length 5.3
  Top Layer w0.3: R11.2 61.42,9.35 61.96,8.81 61.96,7.45
D1: length 26
  Top Layer w0.5: v1(57.51,51.2) 57.56,51.2 ESP1.14
  Bottom Layer w0.5: CN1.1 61.91,55.6 v1(57.51,51.2)
D2: length 26.6
  Top Layer w0.5: v1(54.52,52.74) 54.52,43.69 55.56,42.65 ESP1.13
  Bottom Layer w0.5: v1(54.52,52.74) 59.41,57.63 CN1.2
D8: length 24.8
  Top Layer w0.4: R4.1 53.91,58.54 52.56,57.19 52.56,43.93 49.56,40.93 49.56,39.5
  Top Layer w0.5: ESP1.10 49.56,37.75 50.25,37.06 R8.2
DTR: length 27.9
  Top Layer w0.5: 50.84,20.37 52.17,20.37 52.61,20.8 v1(52.61,21.4) ; 66.86,36.3 67.16,36 Q3.2 66.41,33.55 66.41,31.4 65.11,30.1 60.01,30.1 v1(56.91,27)
  Bottom Layer w0.5: v1(56.91,27) 56.61,26.7 54.41,26.7 52.61,24.9 v1(52.61,21.4)
EN: length 21.9
  Top Layer w0.4: RN1.6 53.64,37.23 54.21,37.8 56.21,37.8 56.56,38.15 56.56,52.48 57.56,53.48 ESP1.3
L_IN: length 14.5
  Top Layer w1: 17.01,2.2 14.71,2.2 14.06,1.55 6.71,1.55 5.75,2.5 P1.1
N_IN: length 23.9
  Top Layer w0.6: P1.2 9.66,6.16 D2.1
  Top Layer w1: R21.1 v1(23.11,4.75) v1(22.36,4.75) v1(21.61,4.75)
  Bottom Layer w1: v1(23.11,4.75) v1(22.36,4.75) v1(21.61,4.75) 11.06,4.75 P1.2
NRES: length 46
  Top Layer w0.5: Q1.3 v1(64.11,36.5) ; RN1.5 54.44,36.73 54.61,36.9 56.01,36.9 56.61,36.3 56.61,32.8 57.01,32.4 61.01,32.4 61.81,33.2 61.81,36.7 62.81,37.7 v1(62.81,37.8) 62.81,47.4 61.56,48.65 ESP1.1
  Top Layer w0.7: C5.2 63.11,57.8 62.71,57.4 62.21,57.4 61.56,56.75 ESP1.1
  Bottom Layer w0.6: v1(62.81,37.8) v1(64.11,36.5)
RTS: length 27.4
  Top Layer w0.5: CH1G.14 52.4,19.1 53.41,20.1 53.41,25 59.41,31 61.31,31 63.16,32.85 Q1.2 63.16,36.75 64.21,37.8 65.35,37.8
RX: length 3.5
  Top Layer w0.8: 59.56,39.5 59.56,38.15 58.61,37.2 58.61,36.35
RX_PRG: length 19.5
  Top Layer w0.5: CH1G.2 58.15,17.83 v1(58.62,17.35)
  Top Layer w0.8: R2.2 v1(58.61,33.3)
  Bottom Layer w0.6: v1(58.61,33.3) 58.62,33.29 v1(58.62,17.35)
SCL: length 82.3
  Top Layer w0.254: v1(50.12,6.65) 50.17,6.65
  Top Layer w0.5: 50.17,10.3 50.17,6.65 ; 51.56,39.5 51.56,37.83 52.04,37.35 RN1.8 ; 32.45,8.3 32.45,7.42 34.57,5.3 48.82,5.3 50.17,6.65
  Top Layer w0.6: v1(66.72,30.06) 68.37,28.41 68.37,21.36 67.13,20.11 U2.4 ; v1(52.01,41.1) 51.56,40.65 ESP1.11
  Bottom Layer w0.5: U2.4 52.62,6.65 v1(50.12,6.65) ; v1(52.01,41.1) 52.01,40.39 54.14,38.26 58.55,38.26 66.72,30.08 v1(66.72,30.06)
SDA: length 87.2
  Top Layer w0.5: RN1.7 52.84,37.7 53.56,38.42 53.56,39.5 ; v1(44.27,6.4) 47.07,6.4 48.17,7.5 CN3.3 ; Q3.3 68.09,32.28 v1(68.09,30.65)
  Top Layer w0.6: 53.96,41.25 v1(53.96,41.26) 53.56,40.85 ESP1.12
  Bottom Layer w0.5: 29.91,8.3 29.91,7.36 30.86,6.4 v1(44.27,6.4) 48.67,6.4 56.37,14.1 58.02,14.1 63.91,19.99 63.91,21.67 64.89,22.65 66.91,22.65 68.09,23.83 v1(68.09,30.65) 57.48,41.25 53.96,41.25
SHIELD: length 8.1
  Top Layer w1: 64.54,2.49 65.89,2.49 66.9,3.5 66.9,8.79
TX: length 3.7
  Top Layer w0.8: ESP1.16 61.56,38.45 60.11,37 60.11,36.35
TX_PRG: length 20.6
  Top Layer w0.5: v1(60.09,17.98) 59.38,17.98 58.26,19.09 CH1G.3
  Top Layer w0.8: R3.2 v1(60.11,33.3)
  Bottom Layer w0.6: v1(60.11,33.3) 60.09,33.28 v1(60.09,17.98)
UD+: length 23.9
  Top Layer w0.3: CH1G.5 55.31,21.64 54.77,21.09 54.77,16.08 55.5,15.35 59.07,15.35 60.17,14.25 60.17,10.55 60.96,9.76 USBC1.B6 60.96,6.41 60.69,6.14 60.17,6.14 59.96,6.35 USBC1.A6
UD-: length 24.8
  Top Layer w0.3: 56.78,22.91 55.22,22.91 54.19,21.87 54.19,15.81 55.2,14.8 58.78,14.8 59.46,14.11 59.46,9.62 ; 59.46,9.62 60.31,9.62 60.46,9.47 USBC1.A7 ; 59.46,9.62 USBC1.B7
X0: length 8.5
  Top Layer w0.6: X1.1 C7.2 60.52,28.51 59.17,27.16 59.17,26.11 58.51,25.44 CH1G.8
X1: length 9
  Top Layer w0.6: 63,24.21 C6.2 60.47,22.21 58.5,24.17 CH1G.7
$1N258: length 5.2
  Top Layer w0.5: 66.86,37.8 68.21,37.8 69.06,36.95 Q3.1
$1N259: length 2.1
  Top Layer w0.5: Q1.1 65.06,36 R1.1
$1N445: length 2.5
  Top Layer w0.6: CH1G.4 59.31,20.36 C3.2
$1N571: length 3.4
  Top Layer w0.4: 53.91,60.45 55.15,60.45 55.96,59.65 Q2.1
$1N918: length 2.6
  Top Layer w0.254: R9.2 LED1.1
$1N1452: length 2.2
  Top Layer w0.8: LED2.1 43.81,61.32 R12.2
$1N12391: length 3
  Top Layer w0.6: R15.2 R16.1
$1N12392: length 4
  Top Layer w0.6: R22.2 30.31,19.91 30.82,20.41 30.82,20.86 31.33,21.37 U5.2
$1N12393: length 8.6
  Top Layer w0.6: R16.2 33.45,25.26 32.6,24.41 U5.3 C16.2
$1N12394: length 6.9
  Top Layer w0.6: U5.4 33.87,21.4 34.02,21.26 34.62,21.26 ; R17.2 36.87,21.11 36.72,21.26 34.62,21.26 ; R20.2 34.72,21.16 34.62,21.26
$1N12400: length 16.8
  Top Layer w0.6: D2.3 12.16,19.87 13.16,20.87 L1.1 9.34,22.47 8.51,23.31 8.51,25.81 6.84,27.47 5.06,27.47
$1N12406: length 15.7
  Top Layer w0.6: 16.98,9.8 12.41,9.8 12.16,10.05 D2.2
  Top Layer w1: R21.2 16.98,9.8 16.98,7.23 F2.2
$1N12488: length 23.3
  Top Layer w0.6: C15.2 24.3,28.23 23.54,27.47 L1.2
  Top Layer w1: C15.2 U5.8 U5.7 U5.6 U5.5 R15.1
$1N12654: length 39.9
  Top Layer w0.254: 7.86,20.96 7.88,20.94
  Top Layer w0.6: C15.1 27.41,23.76 26.51,22.86 24.46,22.86 22.55,20.94 C14.2 19.8,20.94 17.26,18.4 R23.2 v1(15.26,19.95) v1(14.26,19.95) ; D2.4 9.66,19.15 7.88,20.94 C13.2 v1(5.06,18.41) 5.06,17.7
  Bottom Layer w0.6: v1(15.26,19.95) v1(14.26,19.95) 6.6,19.95 v1(5.06,18.41) v1(5.06,17.65)

## Copper pours and planes (outline as drawn; the poured copper is in the pictures)
GND on Top Layer: 27.05,0 27.05,11.5 35.3,11.5 38.22,14.42 38.22,21.21 41.12,24.11 41.12,71.47 41.17,71.52 76.58,71.52 76.88,71.22 76.88,1.35 75.53,0
GND on Bottom Layer: 26.46,0.07 73.98,0.07 73.98,74.74 -0.64,74.74 -1.19,74.19 -1.24,74.19 -1.24,33.66 -12.6,33.76 -12.67,31.21 -1.39,31.36 -1.39,15.95 -1.34,15.9 11.06,15.9 14.57,12.4 25.57,12.4 26.46,11.5

Small or netless copper shapes (teardrops, artwork), in the pictures only: 1 on Top Layer

## Text on the board
Bottom Silkscreen Layer: 5V | GND | RXD | TXD | L | N | SDA | SCL | 3V3 | MAP | Supports sensors | PM10, PM2.5, TVOC | Tmp, Hm, Pr, RadSens | HW: Rev2.1.0 | SW: | AIR QUALITY SENSOR | Develop by Robonomics community
Top Silkscreen Layer: AMS1117 3.3 | CH340G | PWR 3V3 | LCD I2C | L | AC | N | PWR | RadSens | SHT30 | Robonomics.network
